# EAGLE design beacon (EAGLE 6.5.0)
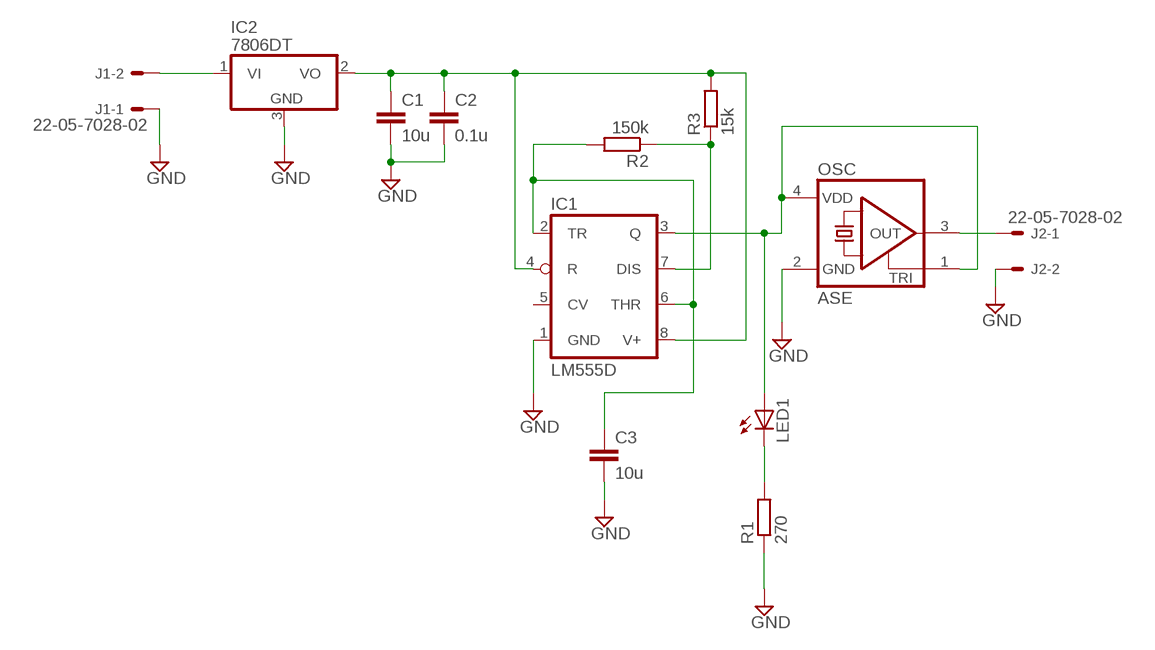
[diagram p0: schematic, sheet 1]

## Parts
C1  10u  C  [C0805]
C2  0.1u  C  [C0805]
C3  10u  C  [C0805]
IC1  LM555D  [SO08]
IC2  7806DT  [TO252]
J1  22-05-7028-02  [7395-02]
J2  22-05-7028-02  [7395-02]
LED1  LED5MM  [LED5MM]
OSC  ASE  [ASE]
R1  270  R  [R0805]
R2  150k  R  [R0805]
R3  15k  R  [R0805]

## Nets
GND: C1.2 C2.2 C3.2 IC1.1(GND) IC2.3(GND) J1.1 J2.2 OSC.2(GND) R1.1
N$1: C3.1 IC1.2(TR) IC1.6(THR) R2.2
N$2: IC1.7(DIS) R2.1 R3.1
N$7: LED1.K(C) R1.2
N$9: J2.1 OSC.3(OUT)
N$11: IC2.1(VI) J1.2
VCC: C1.1 C2.1 IC1.4(R) IC1.8(V+) IC2.2(VO) R3.2
VDD: IC1.3(Q) LED1.A OSC.1(TRI) OSC.4(VDD)
Unconnected: IC1.5(CV)

## Library data of the parts
C1-C3 = eagle-ltspice:C: CAPACITOR, European symbol; SPICEMODEL: NONE; SPICEPREFIX: C
IC1 = linear:*555: TIMER
IC2 = linear:78*: Positive VOLTAGE REGULATOR Source: http://cache.national.com/ds/LM/LM78L05.pdf http://www.fairchildsemi.com/ds/LM/LM7805.pdf
J1 J2 = con-molex:22-?-02: CONNECTOR wire to board 2.54 mm (.1 inch) pitch header; OC_FARNELL: 9731601; OC_NEWARK: unknown
LED1 = led:LED: LED OSRAM: - CHIPLED LG R971, LG N971, LY N971, LG Q971, LY Q971, LO R971, LY R971 LH N974, LH R974 LS Q976, LO Q976, LY Q976 LO Q996 - Hyper CHIPLED LW Q18S LB Q993, LB Q99A, LB R99A - SideLED LS A670, LO A670, LY A670, LG A670, LP A670 LB A673, LV A673, LT A673, LW A673 LH A674 LY A675 LS A676, LA A676, LO A676, LY A676, LW A676 LS A679, LY A679, LG A679 - Hyper Micro SIDELED® LS Y876, LA Y876, LO Y876, LY Y876 LT Y87S - SmartLED LW L88C, LW L88S LB L89C, LB L89S, LG L890 LS L89K, LO L89K, LY L89K LS L896, LA L896, LO L896, LY L896 - TOPLED LS T670, LO T670, LY T670, LG T670, LP T670 LSG T670, LSP T670, LSY T670, LOP T670, LYG T670 LG T671, LOG T671, LSG T671 LB T673, LV T673, LT T673, LW T673 LH T674 LS T676, LA T676, LO T676, LY T676, LB T676, LH T676, LSB T676, LW T676 LB T67C, LV T67C, LT T67C, LS T67K, LO T67K, LY T67K, LW E67C LS E67B, LA E67B, LO E67B, LY E67B, LB E67C, LV E67C, LT E67C LW T67C LS T679, LY T679, LG T679 LS T770, LO T770, LY T770, LG T770, LP T770 LB T773, LV T773, LT T773, LW T773 LH T774 LS E675, LA E675, LY E675, LS T675 LS T776, LA T776, LO T776, LY T776, LB T776 LHGB T686 LT T68C, LB T68C - Hyper Mini TOPLED® LB M676 - Mini TOPLED Santana® LG M470 LS M47K, LO M47K, LY M47K Source: http://www.osram.convergy.de LUXEON: - LUMILED® LXK2-PW12-R00, LXK2-PW12-S00, LXK2-PW14-U00, LXK2-PW14-V00 LXK2-PM12-R00, LXK2-PM12-S00, LXK2-PM14-U00 LXK2-PE12-Q00, LXK2-PE12-R00, LXK2-PE12-S00, LXK2-PE14-T00, LXK2-PE14-U00 LXK2-PB12-K00, LXK2-PB12-L00, LXK2-PB12-M00, LXK2-PB14-N00, LXK2-PB14-P00, LXK2-PB14-Q00 LXK2-PR12-L00, LXK2-PR12-M00, LXK2-PR14-Q00, LXK2-PR14-R00 LXK2-PD12-Q00, LXK2-PD12-R00, LXK2-PD12-S00 LXK2-PH12-R00, LXK2-PH12-S00 LXK2-PL12-P00, LXK2-PL12-Q00, LXK2-PL12-R00 Source: www.luxeon.com KINGBRIGHT: KA-3528ASYC Source: www.kingbright.com
OSC = crystal:ASE: 3.3Vdc CMOS SMD CRYSTAL CLOCK OSCILLATOR SOurce: www.abracon.com; OC_FARNELL: unknown; OC_NEWARK: unknown
R1-R3 = eagle-ltspice:R: RESISTOR, European symbol; SPICEMODEL: NONE; SPICEPREFIX: R

## Board
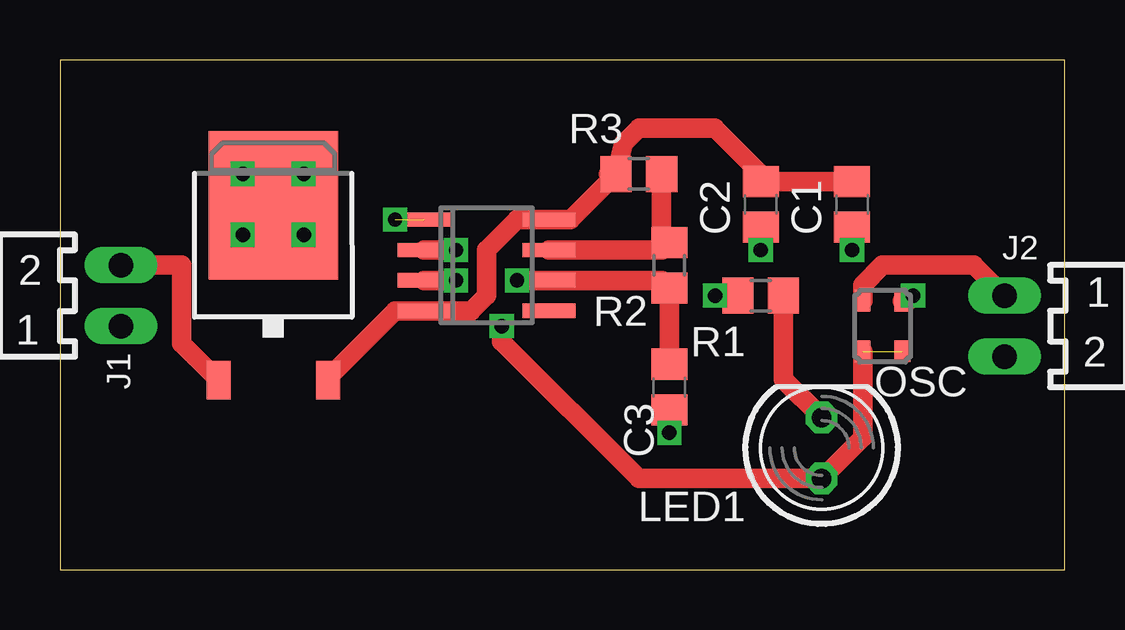
[diagram p1: board, top side]
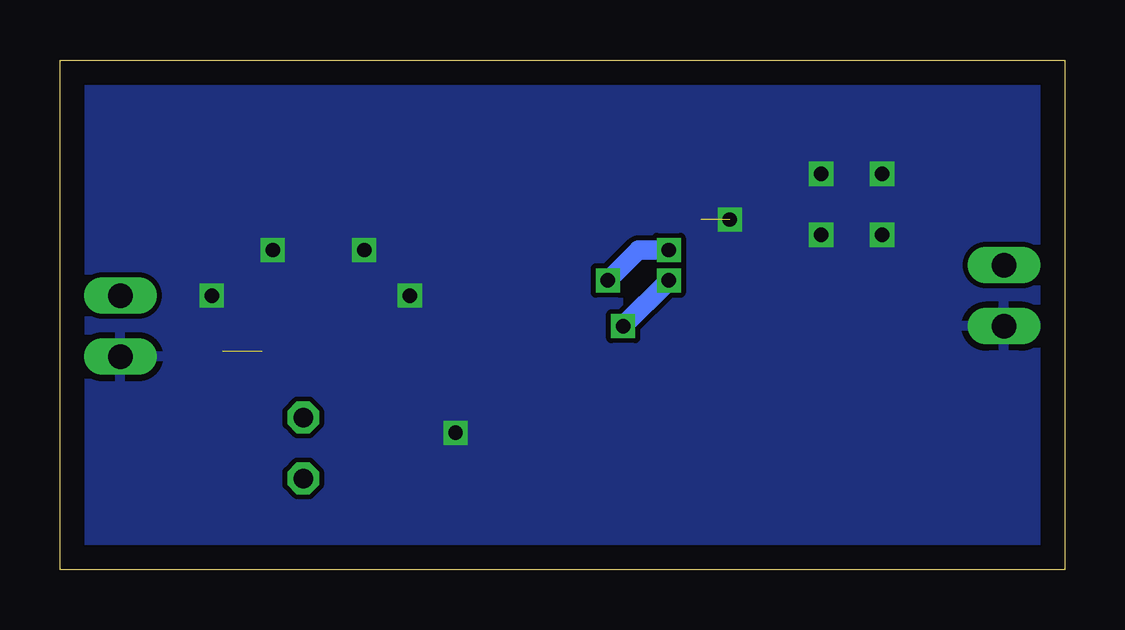
[diagram p2: board, bottom side, seen from below]

Size 41.89 x 21.26 mm. Coordinates in mm from the lower left corner, seen from the top.
Outline: 0,0 41.89,0 41.89,21.26 0,21.26 0,0
Copper layers (1*16): Top 0.035mm / dielectric 1.5mm / Bottom 0.035mm
Design rules "default": minimum track width 10mil, minimum drill 24mil, track to track 8mil, track to pad 8mil, pad to pad 8mil, via to via 8mil, smd to smd 8mil, copper to edge 40mil, drill to drill 8mil, minimum pad ring 10mil, minimum via ring 8mil, stop-mask expansion 4mil, vias tented up to drill 0mil, thermal gap 10mil

### Footprints (pad centres in the part's own frame; a part is rotated, then mirrored left to right if it is on the bottom)
C0805 = smd 1.3 x 1.5: 1 -0.95,0; 2 0.95,0
SO08 = smd 0.6 x 2.2: 1 -1.905,-2.6; 2 -0.635,-2.6; 3 0.635,-2.6; 4 1.905,-2.6; 5 1.905,2.6; 6 0.635,2.6; 7 -0.635,2.6; 8 -1.905,2.6
TO252 = smd 1 x 1.6: 1 -2.28,-4.8; 2 2.28,-4.8 | smd 5.4 x 6.2: 3 0,2.5
7395-02 = drill 1.016 long: 1 1.27,0; 2 -1.27,0
LED5MM = drill 0.813 octagon: A -1.27,0; K 1.27,0
ASE = smd 0.9 x 0.65: 1 -1.05,-0.825; 2 1.05,-0.825; 3 1.05,0.825; 4 -1.05,0.825
R0805 = smd 1.3 x 1.5: 1 -0.95,0; 2 0.95,0

### Placement (x,y rotation side)
C1  33.02,15.24 270 top
C2  29.21,15.24 270 top
C3  25.4,7.62 270 top
IC1  17.78,12.7 270 top
IC2  8.89,12.7 0 top
J1  2.54,11.43 270 top
J2  39.37,10.16 90 top
LED1  31.75,5.08 90 top
OSC  34.29,10.16 90 top
R1  29.21,11.43 0 top
R2  25.4,12.7 270 top
R3  24.13,16.51 180 top

### Tracks (layer width: path | path; a pad name or v marks a point on that pad's centre or on a via)
GND  (via drill 0.6)  (1 unrouted)
  Top 0.406: IC2.3 7.62,15.2 v7.62,13.97
  Top 0.813: C3.2 v25.4,5.71 | C2.2 v29.21,13.33 | OSC.2 35.34,11.21 v35.56,11.43 | v33.02,13.33 C1.2 | R1.1 v27.3,11.43
  other vias: 10.16,16.51 10.16,13.97 7.62,16.51 13.97,14.6
  pour Bottom: 0,21.59 0,0 41.91,0 41.91,21.59
N$1  (via drill 0.6)
  Top 0.813: C3.1 R2.2 25.09,12.06 IC1.6 v19.05,12.06 | IC1.2 v16.51,13.33
  Bottom 0.813: v16.51,13.33 17.78,13.33 v19.05,12.06
N$2
  Top 0.813: IC1.7 25.09,13.33 R2.1 25.08,13.97 R3.1
N$7
  Top 0.813: R1.2 30.16,7.94 LED1.K
N$9
  Top 0.813: OSC.3 33.47,11.88 34.29,12.7 38.1,12.7 J2.1
N$11
  Top 0.813: J1.2 5.08,12.7 5.08,9.43 IC2.1
VCC
  Top 0.813: IC2.2 11.17,7.99 13.97,10.79 IC1.4 17.15,10.79 17.78,11.43 17.78,13.33 19.05,14.6 IC1.8 21.27,14.6 R3.2 | R3.2 22.86,16.51 | C1.1 C2.1 29.21,16.51 27.3,18.41 24.13,18.41 23.5,17.78 R3.2
VDD  (via drill 0.6)  (1 unrouted)
  Top 0.813: OSC.4 33.47,5.52 LED1.A 24.13,3.81 18.41,9.52 v18.41,10.16 | IC1.3 v16.51,12.06
  Bottom 0.813: v16.51,12.06 v18.41,10.16

### Text on the board
tStop: +9V | ANT